# Altium schematic sheet STM32-ROMI_Rev_A_7_Reworks.SchDoc: Reworks
size A4; Organization: Altium Limited; Address1: L3, 12a Rodborough Rd; Address2: Frenchs Forest; Address3: NSW; Address4: Australia 2086; DocumentNumber: 9252020; Revision: A; SheetNumber: 7; SheetTotal: 7
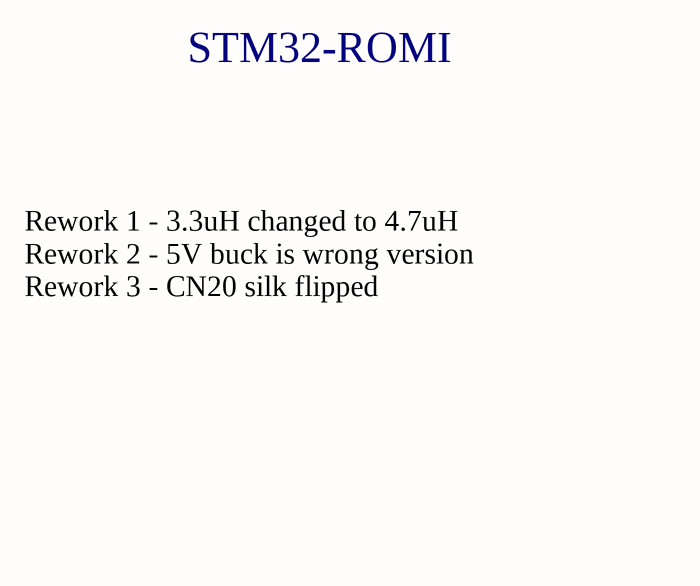
[diagram p0: STM32-ROMI_Rev_A_7_Reworks.SchDoc]

## Notes on the sheet
- STM32-ROMI
- Rework 1 - 3.3uH changed to 4.7uH
  Rework 2 - 5V buck is wrong version
  Rework 3 - CN20 silk flipped
- Title
- Size:
- Date:
- A4
- Number:
- Time:
- Revision:
- Sheet
- of
- File: